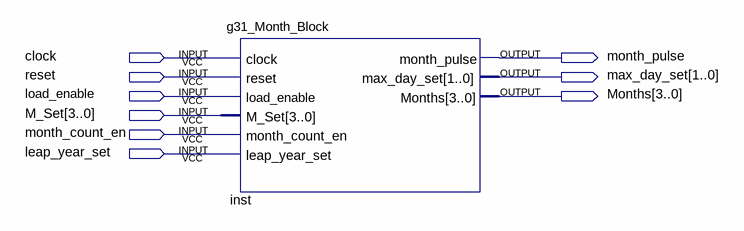
[diagram p0: schematic sheet]
// Quartus schematic g31_month_counter.bdf as structural Verilog: 1 symbols, 9 pins
module g31_month_counter (
  input  clock,
  input  reset,
  input  load_enable,
  input  [3:0] M_Set,
  input  month_count_en,
  input  leap_year_set,
  output month_pulse,
  output [1:0] max_day_set,
  output [3:0] Months
);

  g31_Month_Block inst (
    .clock(clock), .reset(reset), .load_enable(load_enable), .M_Set(M_Set), .month_count_en(month_count_en),
    .leap_year_set(leap_year_set), .month_pulse(month_pulse), .max_day_set(max_day_set), .Months(Months));
endmodule
